# EAGLE design Hall_Sensor (EAGLE 9.2.0)
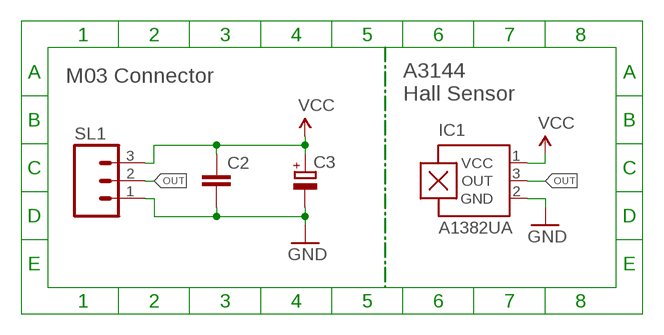
[diagram p0: schematic, sheet 1]

## Parts
C2  C-EU025-025X050  [C025-025X050]
C3  CPOL-EUE2,5-6E  [E2,5-6E]
IC1  A1382UA  [SIP3-UA]
SL1  M03  [03P]

## Nets
GND: C2.2 C3.- IC1.2(GND) SL1.1
OUT: IC1.3(OUT) SL1.2
VCC: C2.1 C3.+ IC1.1(VCC) SL1.3

## Notes on the sheet
- M03 Connector
- A3144 
  Hall Sensor

## Library data of the parts
C2 = rcl:C-EU: CAPACITOR, European symbol
C3 = resistor:CPOL-EU: POLARIZED CAPACITOR, European symbol
IC1 = allegro:A13*?: Linear Hall Effect Sensor ICs Continuous-Time Ratiometric High-Temperature Operation Programmable Linear with Analog Output A1302 -Replacement- UGN3503 Source: http://www.allegromicro.com/en/Products/Part_Numbers/1301/1301.pdf http://www.allegromicro.com/en/Products/Part_Numbers/1321/1321.pdf http://www.allegromicro.com/en/Products/Part_Numbers/1381/1381.pdf; MPN: A1382LUA-T; OC_FARNELL: unknown; OC_NEWARK: 30M9953
SL1 = msp framework:M03: AMP QUICK CONNECTOR

## Board
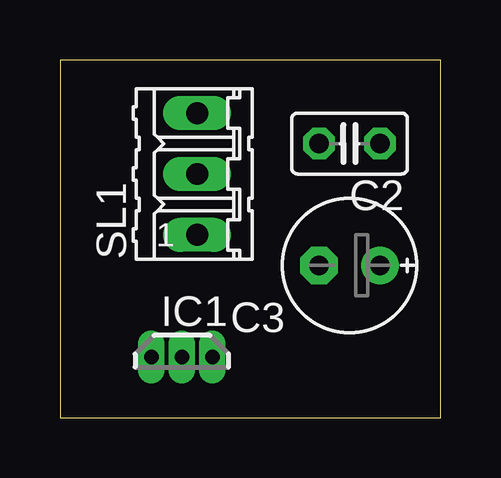
[diagram p1: board, top side]
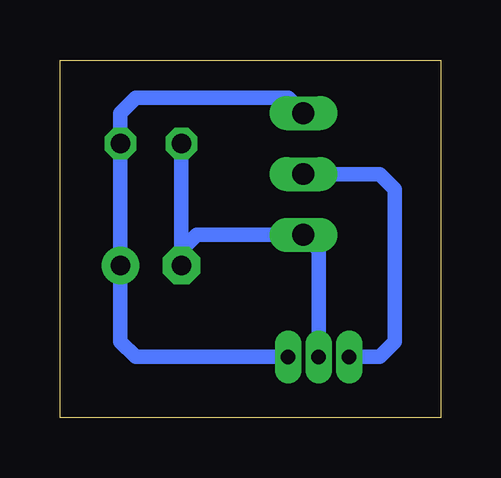
[diagram p2: board, bottom side, seen from below]

Size 15.86 x 14.91 mm. Coordinates in mm from the lower left corner, seen from the top.
Outline: 0,0 15.86,0 15.86,14.91 0,14.91 0,0
Copper layers (1*16): Top 0.035mm / dielectric 1.5mm / Bottom 0.035mm
Design rules "default *": minimum track width 10mil, minimum drill 24mil, track to track 16mil, track to pad 16mil, pad to pad 16mil, via to via 16mil, smd to smd 16mil, copper to edge 40mil, drill to drill 8mil, minimum pad ring 10mil, minimum via ring 10mil, stop-mask expansion 4mil, vias tented up to drill 0mil, thermal gap 10mil

### Footprints (pad centres in the part's own frame; a part is rotated, then mirrored left to right if it is on the bottom)
C025-025X050 = drill 0.813 octagon: 1 -1.27,0; 2 1.27,0
E2,5-6E = drill 0.813 pad 1.575: + -1.27,0 | drill 0.813 pad 1.575 octagon: - 1.27,0
SIP3-UA = drill 0.6 pad 0.7 long: 1 -1.27,0; 2 0,0; 3 1.27,0
03P = drill 0.914 long: 1 -2.54,0; 2 0,0; 3 2.54,0

### Placement (x,y rotation side)
C2  12.06,11.43 180 top
C3  12.06,6.35 180 top
IC1  5.08,2.54 180 top
SL1  5.71,10.16 90 top

### Tracks (layer width: path | path; a pad name or v marks a point on that pad's centre or on a via)
GND
  Bottom 0.61: IC1.2 5.08,6.99 SL1.1 10.16,7.62 10.79,6.99 | 10.79,6.99 C3.- | C2.2 10.79,6.99
OUT
  Bottom 0.61: IC1.3 2.54,2.54 1.91,3.17 1.91,9.53 2.54,10.16 SL1.2
VCC
  Bottom 0.61: IC1.1 12.7,2.54 13.34,3.17 C3.+ C2.1 13.34,12.7 12.7,13.34 6.35,13.34 SL1.3